# Altium schematic sheet DaughterBoard.SchDoc
size A; SheetNumber: 1; SheetTotal: 7
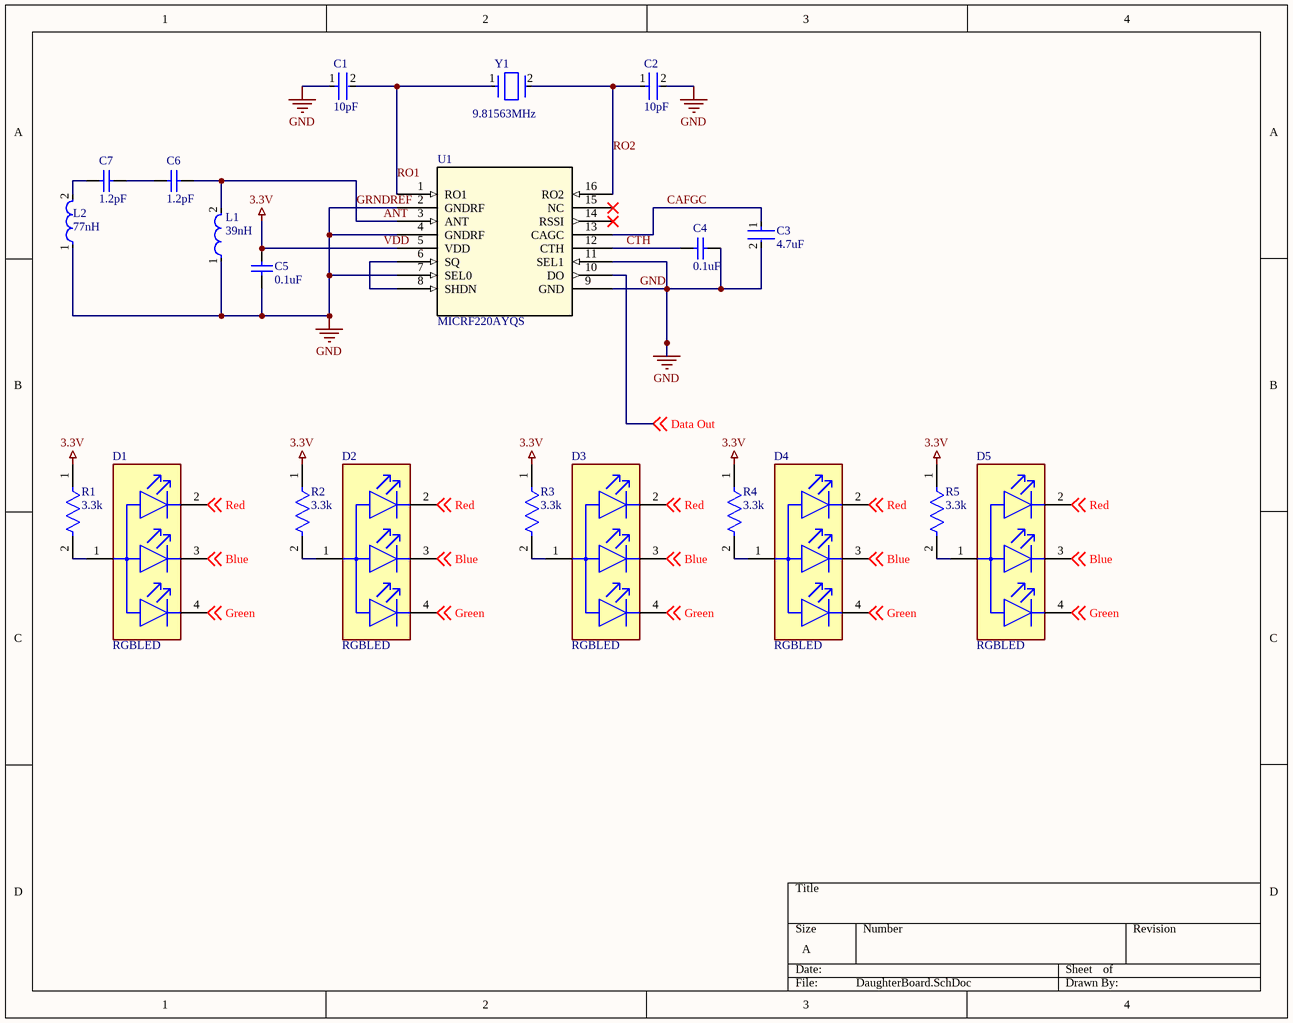
[diagram p0: DaughterBoard.SchDoc]

## Parts
C1  10pF  [FP-C0603C-CF-MFG]
C2  10pF  [FP-C0603C-CF-MFG]
C3  4.7uF  [FP-C1005-050-0_15-IPC_C]
C4  0.1uF  [CAPC1005X56X25LL10T15]
C5  0.1uF  [CAPC1005X56X25LL10T15]
C6  1.2pF  [CAPC1005X55X25LL05T10]
C7  1.2pF  [CAPC1005X55X25LL05T10]
D1  RGBLED  [FP-SML-LX0404SIUPGUSB-MFG]
D2  RGBLED  [FP-SML-LX0404SIUPGUSB-MFG]
D3  RGBLED  [FP-SML-LX0404SIUPGUSB-MFG]
D4  RGBLED  [FP-SML-LX0404SIUPGUSB-MFG]
D5  RGBLED  [FP-SML-LX0404SIUPGUSB-MFG]
L1  39nH  [FP-LQW15AN_80-MFG]
L2  77nH  [FP-LQW15CN_10-MFG]
R1  3.3k  [FP-CRCW0603-e3-IPC_A]
R2  3.3k  [FP-CRCW0603-e3-IPC_A]
R3  3.3k  [FP-CRCW0603-e3-IPC_A]
R4  3.3k  [FP-CRCW0603-e3-IPC_A]
R5  3.3k  [FP-CRCW0603-e3-IPC_A]
U1  MICRF220AYQS  [SOP63P600X175-16N]
Y1  9.81563MHz  [FP-ABM7-MFG]

## Nets
ANT: C1.1 C2.2 C3.2 C4.2 C5.2 C6.2 L1.1 L1.2 L2.1 U1.2(GNDRF) U1.3(ANT) U1.4(GNDRF) U1.7(SEL0) U1.9(GND) U1.11(SEL1)  [also labelled GND, GRNDREF]
VDD: C5.1 R1.1 R2.1 R3.1 R4.1 R5.1 U1.5(VDD)  [also labelled 3.3V]
Blue: D1.3(Blue_C) D2.3(Blue_C) D3.3(Blue_C) D4.3(Blue_C) D5.3(Blue_C) ; off-sheet Blue
CAFGC: C3.1 U1.13(CAGC)
CTH: C4.1 U1.12(CTH)
Data Out: U1.10(DO) ; off-sheet Data Out
Green: D1.4(Green_C) D2.4(Green_C) D3.4(Green_C) D4.4(Green_C) D5.4(Green_C) ; off-sheet Green
Red: D1.2(Red_C) D2.2(Red_C) D3.2(Red_C) D4.2(Red_C) D5.2(Red_C) ; off-sheet Red
RO1: C1.2 U1.1(RO1) Y1.1
RO2: C2.1 U1.16(RO2) Y1.2
NetC6_1: C6.1 C7.2
NetC7_1: C7.1 L2.2
NetD1_1: D1.1(Common_Anode) R1.2
NetD2_1: D2.1(Common_Anode) R2.2
NetD3_1: D3.1(Common_Anode) R3.2
NetD4_1: D4.1(Common_Anode) R4.2
NetD5_1: D5.1(Common_Anode) R5.2
NetU1_6: U1.6(SQ) U1.8(SHDN)

Not connected (* = marked no-connect by the designer): U1 14(RSSI)* 15(NC)*

## Library data of the parts
C1 C2 = CMP-1035-00555-3: CAP CER 10PF 50V NP0 0603; Manufacturer: KEMET; Manufacturer Part Number: C0603C100D5GACTU; Automotive Grade: Grade 1; Temperature Coefficient: 30ppm/°C; Material: Ceramic; Tolerance: 0.5 pF; Temperature Characteristic: C0G; Mouser Description: Multilayer Ceramic Capacitors MLCC - SMD/SMT 50volts 10pF C0G 0.5%; Temperature Range Low: -55°C; Height: 0.87mm; Lead Free: Yes; Device Class L3: Ceramic Capacitors; Digikey Description: CAP CER 10PF 50V NP0 0603; Temperature Range High: +125°C; RoHS: TRUE; Automotive: Yes; Temperature: -55°C to +125°C; Category: Cap; Capacitance: 10 pF; Device Class L1: Passive Components; ComponentLink2Description: Datasheet; Voltage Rating: 50 V; Device Class L2: Capacitors; Octopart: https://octopart.com/c0603c100d5gactu-kemet-9143648; Package: C0603C-CF; ComponentLink2URL: https://api.kemet.com/component-edge/download/datasheet/C0603C100J5GACAUTO.pdf; Value: 10 pF
C3 = CMP-08246-005457-1: CAP CER 4.7UF 6.3V X5R 0402; Dissipation Factor: 10%; Tolerance: 20%; Dielectric Material: Ceramic; Min Operating Temperature: -55°C; Construction: Flat; Voltage Rating (DC): 6.3V; Case Code (Metric): 1005; Voltage: 6.3V; Thickness: 0.026inch; Lead Free: Lead Free; Weight: 2.3E-05oz; Height: 0.5mm; Series: C; Case/Package: 0402; Capacitance: 4.7uF; Dielectric: X5R; Case Code (Imperial): 0402; Width: 0.02inch; Radiation Hardening: No; Packaging: Tape and Reel; Resistor Type: Ceramic; Termination: SMD/SMT; Max Operating Temperature: 85°C; REACH SVHC: No SVHC; Mount: Surface Mount; Package Quantity: 1; Length: 1mm; Voltage Rating: 6.3V; Depth: 0.5mm
C4 C5 = CMP-2008-02743-1: Manufacturer: AVX Interconnect / Elco; Part Number: 04026D104KAT2A
C6 C7 = CMP-1034-00083-2: Part Number: GRM1555C1H1R2WA01D; Manufacturer: Murata
D1-D5 = CMP-2000-07119-2: LED RGB CLEAR SMD; Test Current: 2mA; Wavelength: 465nm; Color: Blue; Lens Style: Square; Power Rating: 30mW; Lens Color: Colorless; Number of LEDs: 3; Viewing Angle: 120°; Luminous Intensity: 20mcd; Forward Voltage: 2.73V; Height: 0.3mm; Lead Free: Lead Free; Max Operating Temperature: 85°C; Mount: Surface Mount; REACH SVHC: No SVHC; Case Code (Imperial): 0404; Forward Current: 2mA; Case Code (Metric): 1010; Lens Transparency: Clear; Length: 1mm; Packaging: Tape and Reel; Min Operating Temperature: -40°C; Package Quantity: 2000; Case/Package: 0404; Width: 1mm
L1 = CMP-06042-001660-1: Wire Wound RF Inductor 39nH ±5% 530mA 0.456Ω 0402 (1005); Test Frequency: 100MHz; Core Material: Non-Magnetic; Q Factor: 28; Self Resonant Frequency: 3.4GHz; Shielding: Unshielded; DC Resistance (DCR): 456mR; Packaging: Tape and Reel; Mount: Surface Mount; Height: 0.5mm; Length: 0.039inch; Max DC Current: 530mA; Tolerance: 5%; Min Operating Temperature: -55°C; Current Rating: 530mA; Case Code (Imperial): 0402; Max Operating Temperature: 125°C; Width: 0.024inch; Case/Package: 0402; Package Quantity: 1; Inductance: 39nH; Height - Seated (Max): 0.024inch; Case Code (Metric): 1005; Resistor Type: Wirewound; Termination: SMD/SMT
L2 = CMP-06042-006679-1: Wire Wound Ferrite RF Inductor For Automotive 77nH ±5% 1100mA 0.09Ω 0402 (1005); Self Resonant Frequency: 2GHz; Current Rating: 1.1A; DC Resistance (DCR): 90mR; Test Frequency: 100MHz; Shielding: Unshielded; Case/Package: 0402; Height - Seated (Max): 0.024inch; Inductance: 77nH; Mount: Surface Mount; Case Code (Imperial): 0402; Packaging: Tape and Reel; Width: 0.02inch; Tolerance: 5%; Case Code (Metric): 1005; Resistor Type: Wirewound; Length: 0.039inch; Core Material: Ferrite; Ratings: AEC-Q200; Min Operating Temperature: -40°C; Max Operating Temperature: 125°C
R1-R5 = CMP-2100-03614-2: RES Thick Film, 3.3kΩ, 1%, 0.1W, 100ppm/°C, 0603; Resistance: 3.3kR; Power Rating: 100mW; Voltage Rating (DC): 75V; Height: 0.45mm; Lead Free: Lead Free; Min Operating Temperature: -55°C; Number of Terminations: 2; Mount: Surface Mount; Max Operating Temperature: 155°C; Package Quantity: 10; Radiation Hardening: No; Features: Automotive AEC-Q200; Depth: 0.85mm; Case Code (Metric): 1608; Termination: SMD/SMT; Width: 0.85mm; Length: 1.55mm; Case Code (Imperial): 0603; Contact Plating: Tin; Temperature Coefficient: 100ppm/°C; Weight: 7.1E-05oz; Packaging: Tape and Reel; Tolerance: 1%; Military Standard: Not; Case/Package: 0603; Working Voltage: 75V; Max Power Dissipation: 100mW; Voltage Rating: 75V; Composition: Thick Film
U1 = MICRF220AYQS: No Description Available; Mfr_Name: Microchip; Copyright: Copyright (C) 2022 Ultra Librarian. All rights reserved.; Manufacturer_Part_Number: MICRF220AYQS; RefDes: RefDes; Type: DEV
Y1 = CMP-27762-013605-1: Crystal 9.81563MHz ±30ppm 10pF SMD-2 6mm x 3.5mm; Frequency Stability: 100ppm; ESR (Equivalent Series Resistance): 50R; Length: 0.236inch; Packaging: Tape and Reel; Width: 0.138inch; Min Operating Temperature: -40°C; Case/Package: SMD/SMT; Height: 0.055inch; Load Capacitance: 10pF; Frequency Tolerance: 30ppm; Frequency: 9.81563MHz; Mount: Surface Mount; Max Operating Temperature: 85°C